# Altium schematic sheet Reference_Voltage_1V65.SchDoc
size A4; SheetNumber: 3; SheetTotal: 4
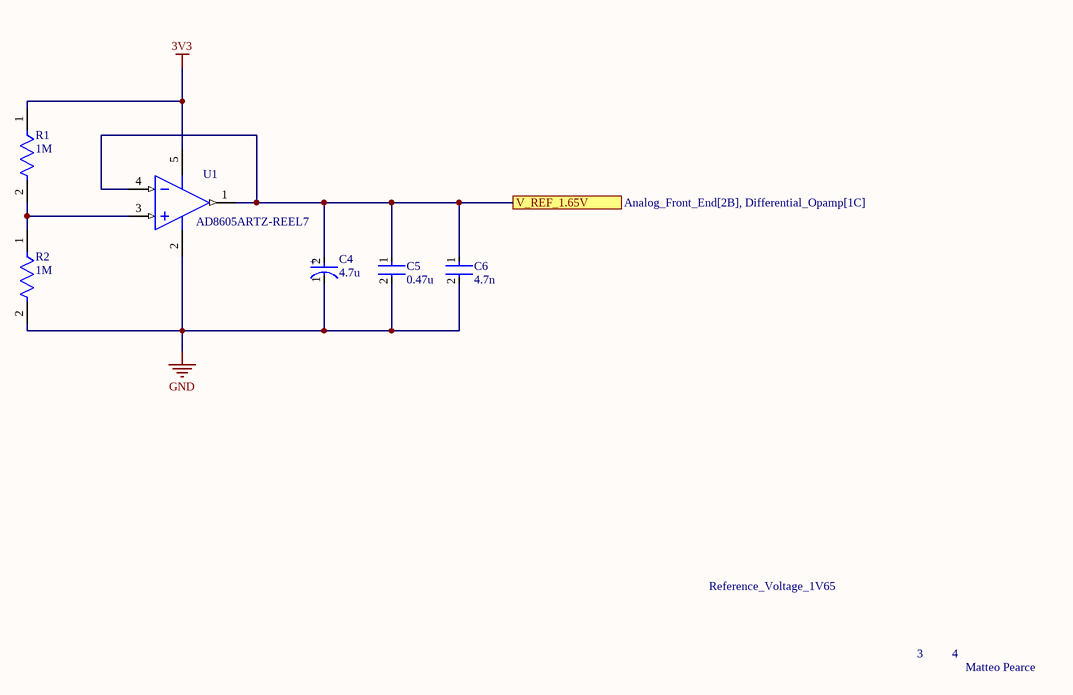
[diagram p0: Reference_Voltage_1V65.SchDoc]

## Parts
C4  4.7u  [FP-TAJA-MFG]
C5  0.47u  [FP-GCM188-0_1-IPC_A]
C6  4.7n  [FP-CC0805-0_85-MFG]
R1  1M  [FP-MCR01-IPC_B]
R2  1M  [FP-MCR01-IPC_B]
U1  AD8605ARTZ-REEL7  [ADI-RJ-5_M]

## Ports
V_REF_1.65V (see Analog_Front_End[2B], Differential_Opamp[1C])

## Nets
3V3: R1.1 U1.5(+V)
GND: C4.1(C) C5.2 C6.2 R2.2 U1.2(-V)
V_REF_1.65V: C4.2(A) C5.1 C6.1 U1.1(OUT) U1.4(-IN) ; port V_REF_1.65V
NetR1_2: R1.2 R2.1 U1.3(+IN)

## Notes on the sheet
- Reference_Voltage_1V65
- 3
- 4
- Matteo Pearce
- (in symbol CMP-04424-000323-2) +

## Library data of the parts
C4 = CMP-04424-000323-2: 4.7uF 20V  ±10% 4Ω 1206  SMD Tantalum Capacitor; NexarPartId: 39985789; Q Factor: 6; Ripple Current: 137mA; Life (Hours): 2000hours; Dissipation Factor: 6%; Capacitance: 4.7µF; Leakage Current: 900nA; Polarity: Polar; Case Code (Imperial): 1206; Min Operating Temperature: -55°C; Length: 3.2mm; Lead Free: Lead Free; Width: 1.6mm; REACH SVHC: No SVHC; ESR (Equivalent Series Resistance): 4Ω; Lead Pitch: 1.1mm; RoHS: Compliant; Voltage Rating: 20V; Packaging: Cut Tape (CT); Height: 1.6mm; Dielectric Material: Tantalum; Voltage Rating (DC): 20V; Number of Pins: 2; Max Operating Temperature: 125°C; Height - Seated (Max): 1.8034mm; Schedule B: 8532210050; Lifecycle Status: Production; Depth: 1.6mm; Radiation Hardening: No; Case/Package: 1206; Features: General Purpose; Case Code (Metric): 3216; Tolerance: 10%; Termination: SMD/SMT; Voltage: 20V; Mount: PCB, Surface Mount
C5 = CMP-2006-02360-2: Ceramic Capacitor for Automotive 470nF  ±10% 16VDC X7R 0603 Paper T/R; Voltage: 16V; Max Operating Temperature: 125°C; Lead Free: Lead Free; Termination: SMD/SMT; Packaging: Tape and Reel; Width: 0.8mm; Mount: Surface Mount; Height: 0.8mm; Package Quantity: 1; Voltage Rating (DC): 16V; Length: 1.6mm; Dielectric: X7R; Case/Package: 0603; Voltage Rating: 16V; REACH SVHC: No SVHC; Thickness: 0.035inch; Min Operating Temperature: -55°C; Tolerance: 10%; Capacitance: 470nF; Depth: 0.8mm; Radiation Hardening: No; Case Code (Metric): 1608; Case Code (Imperial): 0603; Ratings: AEC-Q200
C6 = CMP-03422-000052-1: CAP CER 0.047UF 50V X7R 0805; Manufacturer Part Number: CC0805KRX7R9BB473; Manufacturer: Yageo; Description: CC0805 47 nF X7R 10.00% 50 V; Value: 47 nF; Tolerance: 0.1; Material: Ceramic; Footprint Url: http://www.yageo.com/exep/pages/download/literatures/UPY-C_GEN_24.pdf; ComponentLink2URL: http://www.yageo.com/documents/recent/UPY-GPHC_Y5V_6.3V-to-50V_8.pdf; Ipc Land Pattern Name: CAPC200125X85; Digikey Description: CAP CER 0.047UF 50V X7R 0805; Lead Free: Yes; Octopart: https://octopart.com/cc0805krx7r9bb473-yageo-42181304; Voltage Rating: 50 V; RoHS: TRUE; ComponentLink2Description: Datasheet; Temperature Range High: +85°C; Package: CC0805-0.85; Temperature Range Low: -30°C; Device Class L2: Capacitors; Device Class L3: Ceramic Capacitors; Height: 0.95mm; Temperature: -30°C to +85°C; Category: Cap; Device Class L1: Passive Components; Capacitance: 47 nF; Temperature Characteristic: X7R; Automotive: No; Mouser Description: Multilayer Ceramic Capacitors MLCC - SMD/SMT 47nF 50V X7R 10%
R1 R2 = CMP-08839-008209-1: Thick Film Chip Resistor, 0402, 1MΩ, 0.5%, 50ppm/°C, 0.063W, 50V; Resistance: 1MR; Power Rating: 63mW; Case/Package: 0402; RoHS Compliant: Yes; Voltage Rating (DC): 50V
U1 = CMP-0384-01494-2: Single Channel Wide Bandwidth Operational Amplifier, 10 MHz BW, 5 V/us SR, Industrial, 5-pin SOT23 (RJ-5), Reel; Manufacturer: Analog Devices; Generic Part Number: AD8605; Input Offset Voltage: 20uV; V Span Min: 2.7V; Input Bias Current: 200fA; Slew Rate: 5V/us; V Span Max: 6V; Small Signal Bandwidth: 10MHz; Amplifiers Per Package: 1; Iq/Amp: 1.2mA; ComponentLink2Description: Datasheet; PackageVersion: 121608-A; Mounting Technology: Surface Mount; ComponentLink3URL: http://www.analog.com/static/imported-files/packages/PKG_PDF/SOT-23(RJ)/RJ_5.pdf; Code_JEDEC: MO-178-AA; ComponentLink1Description: Manufacturer URL; ComponentLink4Description: Reference Circuit; RevisionNote: Reference Circuit URL fixed; PartNumber: AD8605ARTZ-REEL7; DatasheetVersion: Rev. L; PackageDescription: 5-Pin Small Outline Transistor Package, Body 2.9 x 1.6 mm, Pitch 0.95 mm; ComponentLink4URL: http://www.analog.com/en/all-operational-amplifiers-op-amps/operational-amplifiers-op-amps/ad8605/products/product.html#product-recommendations; ComponentLink3Description: Package Specification; ComponentLink1URL: http://www.analog.com/en/index.html; PackageReference: RJ-5; ComponentLink2URL: http://www.analog.com/static/imported-files/data_sheets/AD8605_8606_8608.pdf